# EasyEDA schematic FTPLUS v1.1.json
TITLE: FTPLUS; REV: 1.0; Date: 2024-07-09; Sheet: 1/1
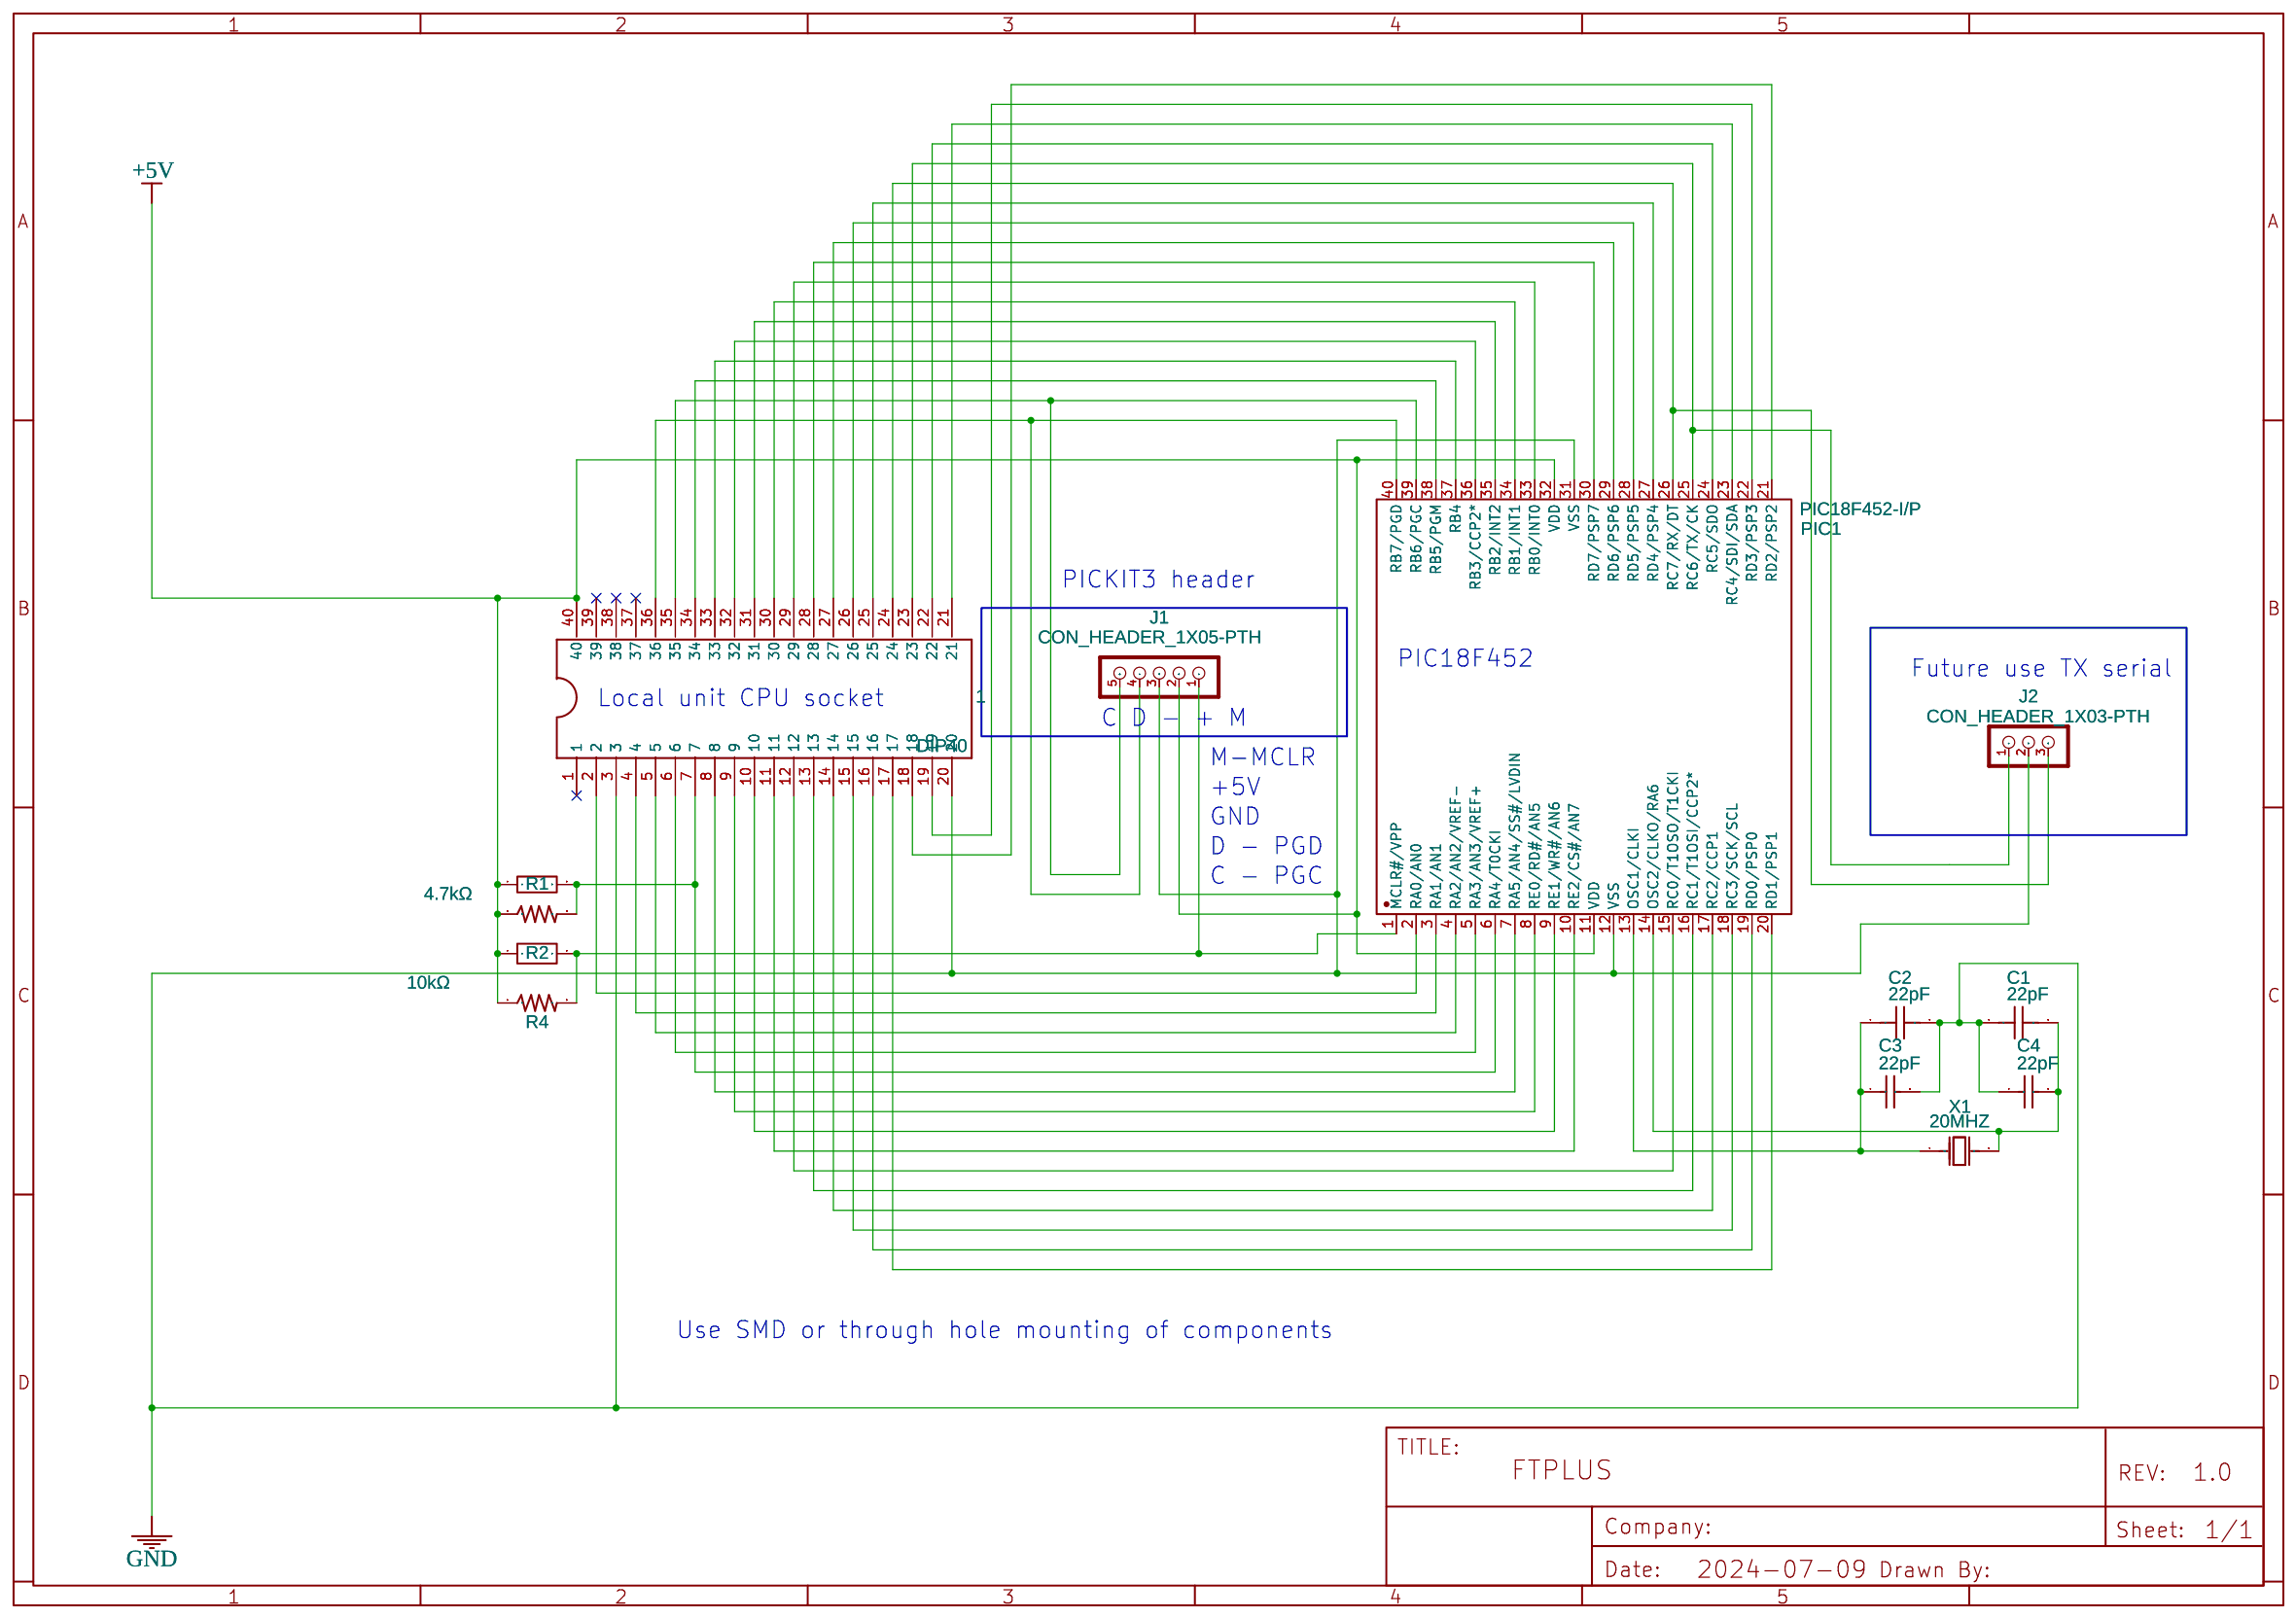
[diagram p0: schematic sheet]

## Parts
1  DIP40  [DIP40_15.24_NOSS]
C1  22pF  [C0603]
C2  22pF  [C0603]
C3  22pF  [RAD-0.1]
C4  22pF  [RAD-0.1]
J1  CON_HEADER_1X05-PTH  [M1X5]
J2  CON_HEADER_1X03-PTH  [M1X3]
PIC1  PIC18F452-I/P  [DIP40_15.24_NOSS]
R1  4.7kΩ  [R0603]
R2  10kΩ  [R0603]
R3  RESISTOR  [AXIAL-0.3EZ]
R4  RESISTOREZ  [AXIAL-0.3EZ]
X1  20MHZ  [OSC-49S-1]

## Library data of the parts
1 = DIP40: Contributor: tspfreitas
C1 C2 = CSA0603C0G220J500JT: Supplier: LCSC; Supplier Part: C18220911; Manufacturer: HRE(芯声); JLCPCB Part Class: Extended Part; Contributor: lcsc
C3 C4 = 22pF: Supplier Part: undefined; Supplier: LCSC; Manufacturer: LCSC; Manufacturer Part: 22K-50V
J1 = CON_HEADER_1X05-PTH: Contributor: DangerousPrototype
J2 = CON_HEADER_1X03-PTH: Contributor: DangerousPrototype
PIC1 = PIC18F452-I/P: Contributor: lcsc; Supplier: LCSC; Supplier Part: C1339870; Manufacturer: MICROCHIP(美国微芯); JLCPCB Part Class: Extended Part; Package Display: No
R1 = 0603WAF4701T5E: Supplier: LCSC; Manufacturer: UNI-ROYAL(厚声); Supplier Part: C23162
R2 = TC0325D1002T5F: Contributor: lcsc; Supplier: LCSC; Supplier Part: C2989345; Manufacturer: UNI-ROYAL(厚声); JLCPCB Part Class: Extended Part
R3 R4 = RESISTOREZ: Resistor; Contributor: SparkFun
X1 = 20MHZ: EasyEDA: C21499; Supplier Part: C21499; Supplier: EasyEDA; Manufacturer: EasyEDA; Manufacturer Part: X49SD20MPB2SC; Contributor: moatazz201

## Nets
+5V: 1.40 J1.2 PIC1.11(VDD) PIC1.32(VDD) R1.1 R2.1 R3.1 R4.1
GND: 1.3 1.20 C1.1 C2.2 C3.2 C4.1 J1.3 J2.2 PIC1.12(VSS) PIC1.31(VSS)
Net-(1-2): 1.2 PIC1.2(RA0/AN0)
Net-(1-4): 1.4 PIC1.3(RA1/AN1)
Net-(1-5): 1.5 PIC1.4(RA2/AN2/VREF-)
Net-(1-6): 1.6 PIC1.5(RA3/AN3/VREF+)
Net-(1-7): 1.7 PIC1.6(RA4/T0CKI) R1.2 R3.2
Net-(1-8): 1.8 PIC1.7(RA5/AN4/SS#/LVDIN)
Net-(1-9): 1.9 PIC1.8(RE0/RD#/AN5)
Net-(1-10): 1.10 PIC1.9(RE1/WR#/AN6)
Net-(1-11): 1.11 PIC1.10(RE2/CS#/AN7)
Net-(1-12): 1.12 PIC1.15(RC0/T1OSO/T1CKI)
Net-(1-13): 1.13 PIC1.16(RC1/T1OSI/CCP2*)
Net-(1-14): 1.14 PIC1.17(RC2/CCP1)
Net-(1-15): 1.15 PIC1.18(RC3/SCK/SCL)
Net-(1-16): 1.16 PIC1.19(RD0/PSP0)
Net-(1-17): 1.17 PIC1.20(RD1/PSP1)
Net-(1-18): 1.18 PIC1.21(RD2/PSP2)
Net-(1-19): 1.19 PIC1.22(RD3/PSP3)
Net-(1-21): 1.21 PIC1.23(RC4/SDI/SDA)
Net-(1-22): 1.22 PIC1.24(RC5/SDO)
Net-(1-23): 1.23 J2.1 PIC1.25(RC6/TX/CK)
Net-(1-24): 1.24 J2.3 PIC1.26(RC7/RX/DT)
Net-(1-25): 1.25 PIC1.27(RD4/PSP4)
Net-(1-26): 1.26 PIC1.28(RD5/PSP5)
Net-(1-27): 1.27 PIC1.29(RD6/PSP6)
Net-(1-28): 1.28 PIC1.30(RD7/PSP7)
Net-(1-29): 1.29 PIC1.33(RB0/INT0)
Net-(1-30): 1.30 PIC1.34(RB1/INT1)
Net-(1-31): 1.31 PIC1.35(RB2/INT2)
Net-(1-32): 1.32 PIC1.36(RB3/CCP2*)
Net-(1-33): 1.33 PIC1.37(RB4)
Net-(1-34): 1.34 PIC1.38(RB5/PGM)
Net-(1-35): 1.35 J1.5 PIC1.39(RB6/PGC)
Net-(1-36): 1.36 J1.4 PIC1.40(RB7/PGD)
Net-(C1-2): C1.2 C4.2 PIC1.14(OSC2/CLKO/RA6) X1.2(OSC2)
Net-(C2-1): C2.1 C3.1 PIC1.13(OSC1/CLKI) X1.1(OSC1)
Net-(J1-1): J1.1 PIC1.1(MCLR#/VPP) R2.2 R4.2

Not connected (* = marked no-connect by the designer): 1 1* 37* 38* 39*

## Notes on the sheet
- PICKIT3 header
- PIC18F452
- Future use TX serial
- Local unit CPU socket
- C D - + M
- M-MCLR
- +5V
- GND
- D - PGD
- C - PGC
- Use SMD or through hole mounting of components
